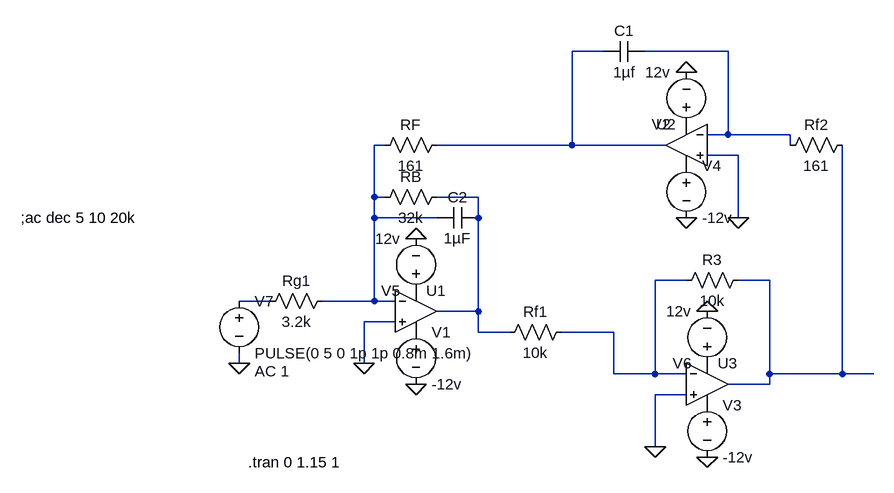
[diagram p0: schematic Band-Pass2.asc]
Band-Pass2.asc, the LTspice schematic file:
Version 4
SHEET 1 880 680
WIRE 336 -208 288 -208
WIRE 528 -208 400 -208
WIRE 528 -80 528 -208
WIRE 528 -80 496 -80
WIRE 624 -80 528 -80
WIRE 0 -64 -16 -64
WIRE 288 -64 288 -208
WIRE 288 -64 80 -64
WIRE 432 -64 288 -64
WIRE 624 -64 624 -80
WIRE 544 -48 496 -48
WIRE -16 16 -16 -64
WIRE 0 16 -16 16
WIRE 144 16 80 16
WIRE -16 48 -16 16
WIRE 80 48 -16 48
WIRE 144 48 144 16
WIRE 544 48 544 -48
WIRE 464 144 416 144
WIRE 592 144 544 144
WIRE -176 176 -224 176
WIRE -16 176 -16 48
WIRE -16 176 -96 176
WIRE 16 176 -16 176
WIRE 144 192 144 48
WIRE 144 192 80 192
WIRE 16 208 -32 208
WIRE 144 224 144 192
WIRE 192 224 144 224
WIRE 352 224 272 224
WIRE -224 272 -224 256
WIRE -32 272 -32 208
WIRE 352 288 352 224
WIRE 416 288 416 144
WIRE 416 288 352 288
WIRE 464 288 416 288
WIRE 592 288 592 144
WIRE 704 288 704 -64
WIRE 704 288 592 288
WIRE 752 288 704 288
WIRE 592 304 592 288
WIRE 592 304 528 304
WIRE 464 320 416 320
WIRE 416 400 416 320
FLAG 544 48 0
FLAG 464 -176 0
FLAG 48 304 0
FLAG 464 48 0
FLAG 48 80 0
FLAG 496 192 0
FLAG -224 272 0
FLAG 416 400 0
FLAG 496 416 0
FLAG -32 272 0
SYMBOL res -80 160 R90
WINDOW 0 0 56 VBottom 2
WINDOW 3 32 56 VTop 2
SYMATTR InstName Rg1
SYMATTR Value 3.2k
SYMBOL Opamps\\UniversalOpamp2 48 192 R0
SYMATTR InstName U1
SYMBOL Opamps\\UniversalOpamp2 464 -64 M0
SYMATTR InstName U2
SYMBOL Opamps\\UniversalOpamp2 496 304 R0
SYMATTR InstName U3
SYMBOL res 96 -80 R90
WINDOW 0 0 56 VBottom 2
WINDOW 3 32 56 VTop 2
SYMATTR InstName RF
SYMATTR Value 161
SYMBOL cap 400 -224 R90
WINDOW 0 0 32 VBottom 2
WINDOW 3 32 32 VTop 2
SYMATTR InstName C1
SYMATTR Value 1µf
SYMBOL res 288 208 R90
WINDOW 0 0 56 VBottom 2
WINDOW 3 32 56 VTop 2
SYMATTR InstName Rf1
SYMATTR Value 10k
SYMBOL res 608 -48 R270
WINDOW 0 32 56 VTop 2
WINDOW 3 0 56 VBottom 2
SYMATTR InstName Rf2
SYMATTR Value 161
SYMBOL voltage 48 208 R0
WINDOW 123 0 0 Left 2
WINDOW 39 0 0 Left 2
SYMATTR InstName V1
SYMATTR Value -12v
SYMBOL voltage 464 -80 R180
WINDOW 123 0 0 Left 2
WINDOW 39 0 0 Left 2
SYMATTR InstName V2
SYMATTR Value 12v
SYMBOL voltage 496 320 R0
WINDOW 123 0 0 Left 2
WINDOW 39 0 0 Left 2
SYMATTR InstName V3
SYMATTR Value -12v
SYMBOL voltage 464 -48 R0
WINDOW 123 0 0 Left 2
WINDOW 39 0 0 Left 2
SYMATTR InstName V4
SYMATTR Value -12v
SYMBOL voltage 48 176 R180
WINDOW 123 0 0 Left 2
WINDOW 39 0 0 Left 2
SYMATTR InstName V5
SYMATTR Value 12v
SYMBOL voltage 496 288 R180
WINDOW 123 0 0 Left 2
WINDOW 39 0 0 Left 2
SYMATTR InstName V6
SYMATTR Value 12v
SYMBOL voltage -224 160 R0
WINDOW 123 24 124 Left 2
WINDOW 39 0 0 Left 2
SYMATTR InstName V7
SYMATTR Value PULSE(0 5 0 1p 1p 0.8m 1.6m)
SYMATTR Value2 AC 1
SYMBOL res 560 128 R90
WINDOW 0 0 56 VBottom 2
WINDOW 3 32 56 VTop 2
SYMATTR InstName R3
SYMATTR Value 10k
SYMBOL cap 144 32 R90
WINDOW 0 0 32 VBottom 2
WINDOW 3 32 32 VTop 2
SYMATTR InstName C2
SYMATTR Value 1µF
SYMBOL res 96 0 R90
WINDOW 0 0 56 VBottom 2
WINDOW 3 32 56 VTop 2
SYMATTR InstName RB
SYMATTR Value 32k
TEXT -210 424 Left 2 !.tran 0 1.15 1
TEXT -560 48 Left 2 !;ac dec 5 10 20k

The netlist it stands for:
* Band-Pass2.asc
Rg1 N003 N007 3.2k
XU1 0 N003 P001 P002 N004 level.2 Avol=1Meg GBW=10Meg Slew=10Meg ilimit=25m rail=0 Vos=0 phimargin=45 en=0 enk=0 in=0 ink=0 Rin=500Meg  ; pins IN+ IN- V+ V- OUT
XU2 0 N002 P003 P004 N001 level.2 Avol=1Meg GBW=10Meg Slew=10Meg ilimit=25m rail=0 Vos=0 phimargin=45 en=0 enk=0 in=0 ink=0 Rin=500Meg  ; pins IN+ IN- V+ V- OUT
XU3 0 N005 P005 P006 N006 level.2 Avol=1Meg GBW=10Meg Slew=10Meg ilimit=25m rail=0 Vos=0 phimargin=45 en=0 enk=0 in=0 ink=0 Rin=500Meg  ; pins IN+ IN- V+ V- OUT
RF N001 N003 161
C1 N002 N001 1µf
Rf1 N005 N004 10k
Rf2 N002 N006 161
V1 P002 0 -12v
V2 P003 0 12v
V3 P006 0 -12v
V4 P004 0 -12v
V5 P001 0 12v
V6 P005 0 12v
V7 N007 0 PULSE(0 5 0 1p 1p 0.8m 1.6m) AC 1
R3 N006 N005 10k
C2 N004 N003 1µF
RB N004 N003 32k
.tran 0 1.15 1
;ac dec 5 10 20k
.lib UniversalOpamps2.sub
.backanno
.end